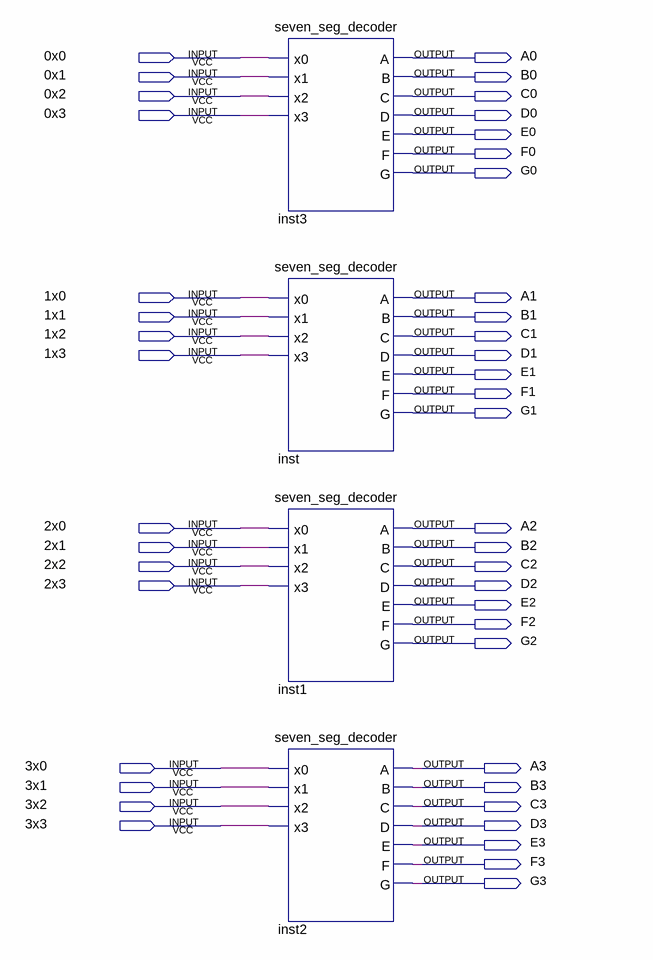
[diagram p0: schematic sheet]
// Quartus schematic lab5step1.bdf as structural Verilog: 4 symbols, 44 pins
module lab5step1 (
  input  \0x0 ,
  input  \0x1 ,
  input  \0x2 ,
  input  \0x3 ,
  input  \1x0 ,
  input  \1x1 ,
  input  \1x2 ,
  input  \1x3 ,
  input  \2x0 ,
  input  \2x1 ,
  input  \2x2 ,
  input  \2x3 ,
  input  \3x0 ,
  input  \3x1 ,
  input  \3x2 ,
  input  \3x3 ,
  output A0,
  output B0,
  output C0,
  output D0,
  output E0,
  output F0,
  output G0,
  output A1,
  output B1,
  output C1,
  output D1,
  output E1,
  output F1,
  output G1,
  output A2,
  output B2,
  output C2,
  output D2,
  output E2,
  output F2,
  output G2,
  output A3,
  output B3,
  output C3,
  output D3,
  output E3,
  output F3,
  output G3
);

  seven_seg_decoder inst3 (
    .x0(\0x0 ), .x1(\0x1 ), .x2(\0x2 ), .x3(\0x3 ), .A(A0), .B(B0), .C(C0), .D(D0), .E(E0), .F(F0), .G(G0));
  seven_seg_decoder inst (
    .x0(\1x0 ), .x1(\1x1 ), .x2(\1x2 ), .x3(\1x3 ), .A(A1), .B(B1), .C(C1), .D(D1), .E(E1), .F(F1), .G(G1));
  seven_seg_decoder inst1 (
    .x0(\2x0 ), .x1(\2x1 ), .x2(\2x2 ), .x3(\2x3 ), .A(A2), .B(B2), .C(C2), .D(D2), .E(E2), .F(F2), .G(G2));
  seven_seg_decoder inst2 (
    .x0(\3x0 ), .x1(\3x1 ), .x2(\3x2 ), .x3(\3x3 ), .A(A3), .B(B3), .C(C3), .D(D3), .E(E3), .F(F3), .G(G3));
endmodule
